# EasyEDA Pro project icm20948.epro

# Schematic icm20948
Create Date: 2025-06-27; Page Name: P1; Project Name: mousring; Schematic Name: icm20948; Update Date: 2025-06-27; Company: EasyEDA.com; Page Size: A4; Version: V1.0
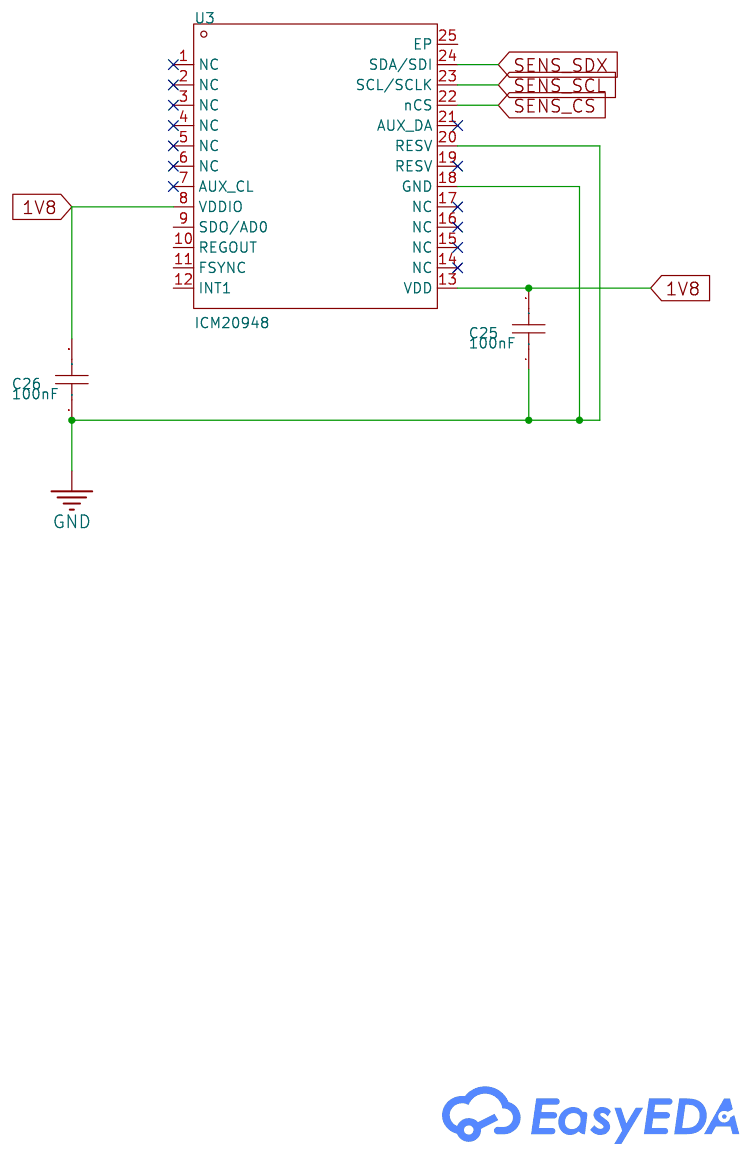
[diagram p0: schematic sheet]

## Parts
C25  100nF  [C0201]
C26  100nF  [C0201]
U3  ICM20948  [QFN-24_L3.0-W3.0-P0.40-BL-EP]

## Library data of the parts
C25 C26 = C0201X5R104K100NTA: Capacitance:100nF Tolerance:±10% Tolerance:±10% Voltage Rating:10V Temperature Coefficient:X5R; LCSC Part Name: 100nF ±10% 10V; Supplier Part: C115574; Manufacturer: EYANG(宇阳科技); Supplier Footprint: 0201; JLCPCB Part Class: Extended Part; Datasheet: https://atta.szlcsc.com/upload/public/pdf/source/20190320/C377537_BBE5FC54ADCBA21EA65467531FECB98A.pdf; Supplier: LCSC; Tolerance: ±10%; Voltage Rating: 10V; Temperature Coefficient: X5R
U3 = ICM20948: Supplier Part: C2683596; Supplier Footprint: DFN-24-EP(3.0x3.0); JLCPCB Part Class: Extended Part; Supplier: LCSC

## Nets
1V8: C25.2 C26.2 U3.8(VDDIO) U3.13(VDD)
GND: C25.1 C26.1 U3.18(GND) U3.20(RESV)
SENS_CS: U3.22(nCS)
SENS_SCL: U3.23(SCL/SCLK)
SENS_SDX: U3.24(SDA/SDI)

Not connected (* = marked no-connect by the designer): U3 1(NC)* 2(NC)* 3(NC)* 4(NC)* 5(NC)* 6(NC)* 7(AUX_CL)* 9(SDO/AD0) 10(REGOUT) 11(FSYNC) 12(INT1) 14(NC)* 15(NC)* 16(NC)* 17(NC)* 19(RESV)* 21(AUX_DA)* 25(EP)
